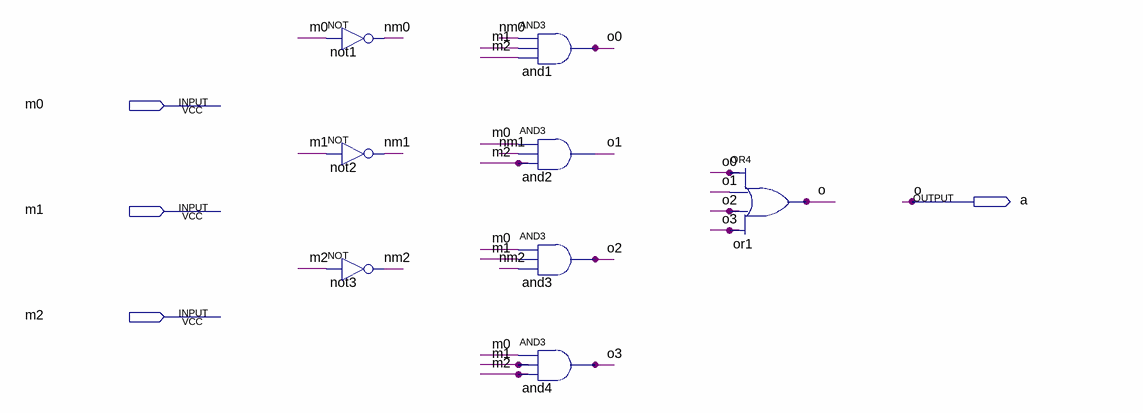
[diagram p0: schematic sheet]
// Quartus schematic S03E01.bdf as structural Verilog: 8 symbols, 4 pins
module S03E01 (
  input  m0,
  input  m1,
  input  m2,
  output a
);

  wire nm0, nm1, nm2, o0, o1, o2, o3;

  not not1 (nm0, m0);
  not not2 (nm1, m1);
  not not3 (nm2, m2);
  and and1 (o0, nm0, m1, m2);
  and and2 (o1, m0, nm1, m2);
  and and3 (o2, m0, m1, nm2);
  and and4 (o3, m0, m1, m2);
  or or1 (a, o0, o1, o2, o3);

  // Other names for the same wires on the sheet: o = a
endmodule
